# EAGLE schematic main_board (EAGLE 9.6.2)
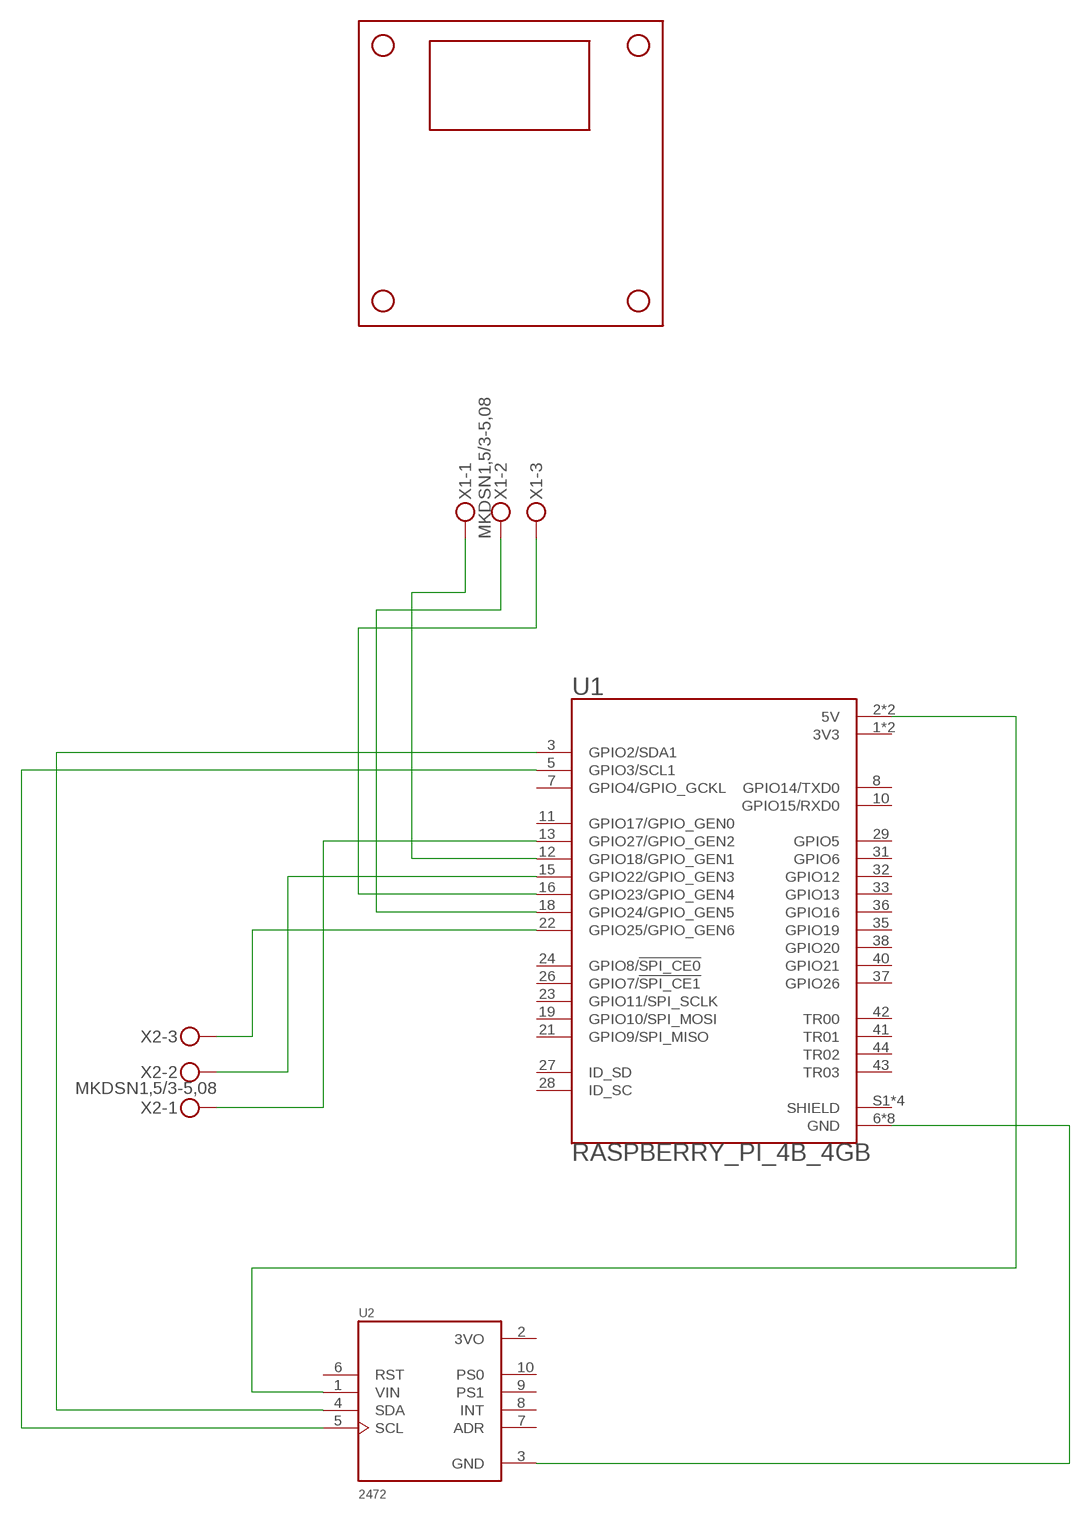
[diagram p0: schematic, sheet 1]

## Parts
L298N1  L298N_DRIVER  [L298N_DRIVER]
U1  RASPBERRY_PI_4B_4GB  [MODULE_RASPBERRY_PI_4B_4GB]
U2  2472  [MODULE_2472]
X1  MKDSN1,5/3-5,08  [MKDSN1,5/3-5,08]
X2  MKDSN1,5/3-5,08  [MKDSN1,5/3-5,08]

## Nets
N$1: U1.2(5V) U1.4(5V) U2.1(VIN)
N$2: U1.6(GND) U1.9(GND) U1.14(GND) U1.20(GND) U1.25(GND) U1.30(GND) U1.34(GND) U1.39(GND) U2.3(GND)
N$3: U1.3(GPIO2/SDA1) U2.4(SDA)
N$4: U1.5(GPIO3/SCL1) U2.5(SCL)
N$5: U1.12(GPIO18/GPIO_GEN1) X1.1
N$6: U1.18(GPIO24/GPIO_GEN5) X1.2
N$7: U1.16(GPIO23/GPIO_GEN4) X1.3
N$8: U1.13(GPIO27/GPIO_GEN2) X2.1
N$9: U1.15(GPIO22/GPIO_GEN3) X2.2
N$10: U1.22(GPIO25/GPIO_GEN6) X2.3
Unconnected: U1.7(GPIO4/GPIO_GCKL) U1.8(GPIO14/TXD0) U1.10(GPIO15/RXD0) U1.11(GPIO17/GPIO_GEN0) U1.19(GPIO10/SPI_MOSI) U1.21(GPIO9/SPI_MISO) U1.23(GPIO11/SPI_SCLK) U1.24(GPIO8/!SPI_CE0!) U1.26(GPIO7/!SPI_CE1!) U1.27(ID_SD) U1.28(ID_SC) U1.29(GPIO5) U1.31(GPIO6) U1.32(GPIO12) U1.33(GPIO13) U1.35(GPIO19) U1.36(GPIO16) U1.37(GPIO26) U1.38(GPIO20) U1.40(GPIO21) U1.41(TR01) U1.42(TR00) U1.43(TR03) U1.44(TR02) U2.6(RST) U2.7(ADR) U2.8(INT) U2.9(PS1) U2.10(PS0)

## Power pins joined to a net without a drawn wire
3V3: U1.1(3V3) U1.17(3V3)
3VO: U2.2(3VO)
SHIELD: U1.S1(SHIELD) U1.S2(SHIELD) U1.S3(SHIELD) U1.S4(SHIELD)

## Library data of the parts
L298N1 = L298N_Motor_Driver:L298N_DRIVER
U1 = RASPBERRY_PI_4B_4GB:RASPBERRY_PI_4B_4GB: Check availability <https://pricing.snapeda.com/parts/RASPBERRY%20PI%204B/4GB/Raspberry%20Pi/view-part?ref=eda>; AVAILABILITY: In Stock; CHECK_PRICES: https://www.snapeda.com/parts/RASPBERRY%20PI%204B/4GB/Raspberry+Pi/view-part/?ref=eda; DESCRIPTION: BCM2711 Raspberry Pi 4 Model B 4GB - ARM® Cortex®-A72 MPU Embedded Evaluation Board; MF: Raspberry Pi; MP: RASPBERRY PI 4B/4GB; PACKAGE: None; PRICE: None; SNAPEDA_LINK: https://www.snapeda.com/parts/RASPBERRY%20PI%204B/4GB/Raspberry+Pi/view-part/?ref=snap
U2 = BNO055_IMU:2472: Check availability <https://pricing.snapeda.com/parts/2472/Adafruit/view-part?ref=eda>; AVAILABILITY: In Stock; CHECK_PRICES: https://www.snapeda.com/parts/2472/Adafruit+Industries/view-part/?ref=eda; DESCRIPTION: Adafruit 9-DOF Absolute Orientation IMU Fusion Breakout - BNO055 | Adafruit Industries 2472; MF: Adafruit; MP: 2472; PACKAGE: Non-Standard Adafruit; PRICE: None; PURCHASE-URL: https://www.snapeda.com/api/url_track_click_mouser/?unipart_id=6348449&manufacturer=Adafruit&part_name=2472&search_term=bno055; SNAPEDA_LINK: https://www.snapeda.com/parts/2472/Adafruit+Industries/view-part/?ref=snap
X1 X2 = con-phoenix-508:MKDSN1,5/3-5,08: MKDSN 1,5/ 3-5,08 Printklemme Nennstrom: 13,5 A Nennspannung: 250 V Rastermaß: 5,08 mm Polzahl: 3 Anschlussart: Schraubanschluss Montage: Löten Anschlussrichtung Leiter/Platine: 0 ° Artikelnummer: 1729131 Source: http://eshop.phoenixcontact.com .. 1729131.pdf